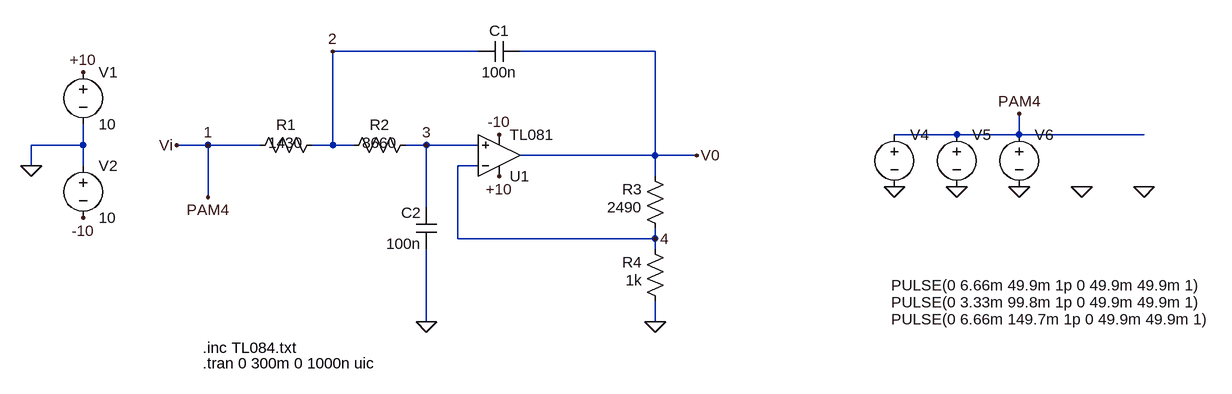
[diagram p0: schematic Draft2.asc]
Draft2.asc, the LTspice schematic file:
Version 4
SHEET 1 1980 680
WIRE 464 -192 240 -192
WIRE 736 -192 528 -192
WIRE 1200 -64 1104 -64
WIRE 1296 -64 1296 -96
WIRE 1296 -64 1200 -64
WIRE 1488 -64 1296 -64
WIRE -144 -48 -144 -80
WIRE -144 -48 -224 -48
WIRE 48 -48 0 -48
WIRE 128 -48 48 -48
WIRE 240 -48 240 -192
WIRE 240 -48 208 -48
WIRE 272 -48 240 -48
WIRE 384 -48 352 -48
WIRE 464 -48 384 -48
WIRE 736 -32 736 -192
WIRE 736 -32 528 -32
WIRE 800 -32 736 -32
WIRE -224 -16 -224 -48
WIRE -144 -16 -144 -48
WIRE 464 -16 432 -16
WIRE 736 0 736 -32
WIRE 48 32 48 -48
WIRE 384 48 384 -48
WIRE 432 96 432 -16
WIRE 736 96 736 80
WIRE 736 96 432 96
WIRE 736 112 736 96
WIRE 384 224 384 112
WIRE 736 224 736 192
FLAG -224 -16 0
FLAG -144 -160 +10
FLAG -144 64 -10
FLAG 496 0 +10
FLAG 496 -64 -10
FLAG 384 224 0
FLAG 736 224 0
FLAG 800 -32 V0
FLAG 0 -48 Vi
FLAG 48 -48 1
FLAG 240 -192 2
FLAG 384 -48 3
FLAG 736 96 4
FLAG 1104 16 0
FLAG 1200 16 0
FLAG 1296 16 0
FLAG 1392 16 0
FLAG 1488 16 0
FLAG 1296 -96 PAM4
FLAG 48 32 PAM4
SYMBOL OpAmps\\opamp2 496 32 M180
SYMATTR InstName U1
SYMATTR Value TL081
SYMBOL voltage -144 -176 R0
SYMATTR InstName V1
SYMATTR Value 10
SYMBOL voltage -144 -32 R0
SYMATTR InstName V2
SYMATTR Value 10
SYMBOL res 224 -64 R90
WINDOW 0 0 56 VBottom 2
WINDOW 3 28 56 VBottom 2
SYMATTR InstName R1
SYMATTR Value 1430
SYMBOL res 368 -64 R90
WINDOW 0 0 56 VBottom 2
WINDOW 3 28 56 VBottom 2
SYMATTR InstName R2
SYMATTR Value 8660
SYMBOL res 752 96 R180
WINDOW 0 36 76 Left 2
WINDOW 3 36 48 Left 2
SYMATTR InstName R3
SYMATTR Value 2490
SYMBOL res 752 208 R180
WINDOW 0 36 76 Left 2
WINDOW 3 36 48 Left 2
SYMATTR InstName R4
SYMATTR Value 1k
SYMBOL cap 528 -208 R90
WINDOW 0 0 32 VBottom 2
WINDOW 3 32 32 VTop 2
SYMATTR InstName C1
SYMATTR Value 100n
SYMBOL cap 400 112 R180
WINDOW 0 24 56 Left 2
WINDOW 3 24 8 Left 2
SYMATTR InstName C2
SYMATTR Value 100n
SYMBOL voltage 1104 -80 R0
WINDOW 3 -5 248 Left 2
WINDOW 123 0 0 Left 0
WINDOW 39 0 0 Left 0
SYMATTR InstName V4
SYMATTR Value PULSE(0 6.66m 49.9m 1p 0 49.9m 49.9m 1)
SYMBOL voltage 1200 -80 R0
WINDOW 3 -101 274 Left 2
WINDOW 123 0 0 Left 0
WINDOW 39 0 0 Left 0
SYMATTR InstName V5
SYMATTR Value PULSE(0 3.33m 99.8m 1p 0 49.9m 49.9m 1)
SYMBOL voltage 1296 -80 R0
WINDOW 3 -197 300 Left 2
WINDOW 123 0 0 Left 0
WINDOW 39 0 0 Left 0
SYMATTR InstName V6
SYMATTR Value PULSE(0 6.66m 149.7m 1p 0 49.9m 49.9m 1)
TEXT 40 264 Left 2 !.inc TL084.txt
TEXT 40 288 Left 2 !.tran 0 300m 0 1000n uic

The netlist it stands for:
* Draft2.asc
XU1 3 4 +10 -10 V0 TL081  ; pins In+ In- V+ V- OUT
V1 +10 0 10
V2 0 -10 10
R1 2 PAM4 1430
R2 3 2 8660
R3 4 V0 2490
R4 0 4 1k
C1 V0 2 100n
C2 0 3 100n
V4 PAM4 0 PULSE(0 6.66m 49.9m 1p 0 49.9m 49.9m 1)
V5 PAM4 0 PULSE(0 3.33m 99.8m 1p 0 49.9m 49.9m 1)
V6 PAM4 0 PULSE(0 6.66m 149.7m 1p 0 49.9m 49.9m 1)
.inc TL084.txt
.tran 0 300m 0 1000n uic
.backanno
.end